# Altium schematic sheet 自控mosV1.0.SchDoc
size A3
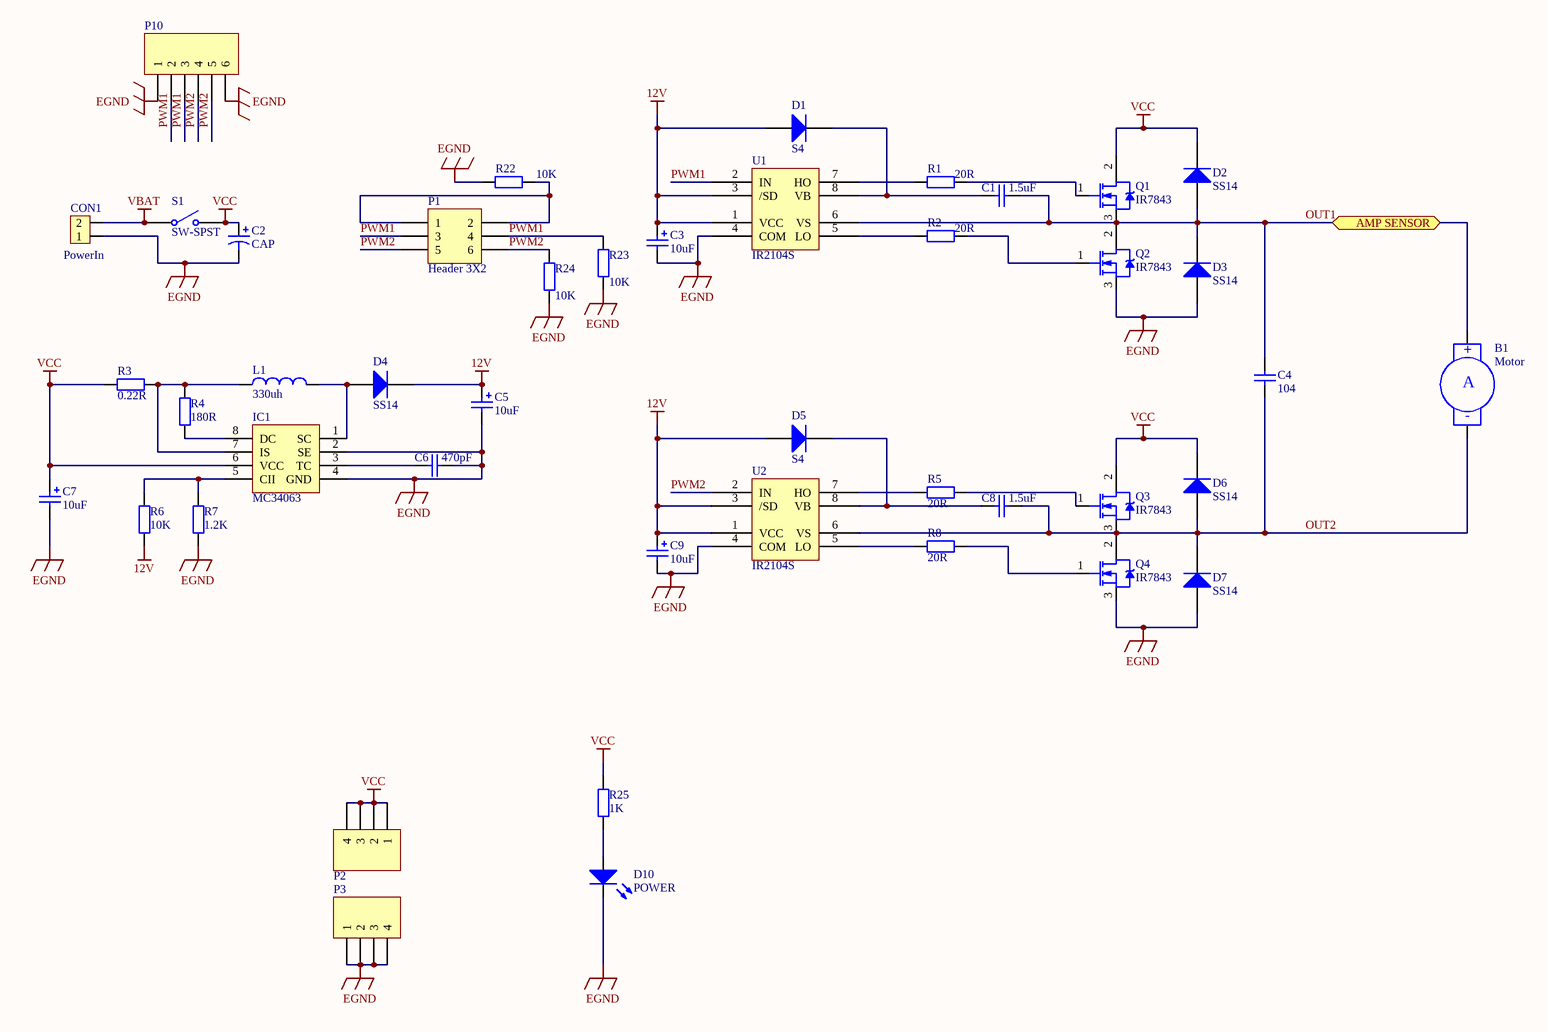
[diagram p0: 自控mosV1.0.SchDoc]

## Parts
B1  Motor  [KF301-2P]
C1  value 1.5uF  [C2012]  (hidden comment: Cap)
C2  CAP  [SMD-EC-F5]
C3  value 10uF  [C2012]  (hidden comment: Cap Pol1)
C4  value 104  [C2012]  (hidden comment: Cap)
C5  value 10uF  [1206C]  (hidden comment: Cap Pol1)
C6  value 470pF  [C2012]  (hidden comment: Cap)
C7  value 10uF  [1206C]  (hidden comment: Cap Pol1)
C8  value 1.5uF  [C2012]  (hidden comment: Cap)
C9  value 10uF  [C2012]  (hidden comment: Cap Pol1)
CON1  PowerIn  [KF301-2P]
D1  S4  [R2012]
D2  SS14  [hole-chip diode]
D3  SS14  [hole-chip diode]
D4  SS14  [hole-chip diode]
D5  S4  [R2012]
D6  SS14  [hole-chip diode]
D7  SS14  [hole-chip diode]
D10  POWER  [C2012]
IC1  MC34063  [MC34063]
L1  value 330uh  [SMD-EC-F12.5]  (hidden comment: Inductor)
P1  Header 3X2  [HDR2X3]
P2  Header 4  [HDR1X4]  (value not drawn)
P3  Header 4  [HDR1X4]  (value not drawn)
P10  Header 6  [FFC/SM1.0-2H6]  (value not drawn)
Q1  IR7843  [LR7843]
Q2  IR7843  [LR7843]
Q3  IR7843  [LR7843]
Q4  IR7843  [LR7843]
R1  value 20R  [R2012]  (hidden comment: Res2)
R2  value 20R  [R2012]  (hidden comment: Res2)
R3  value 0.22R  [SK54]  (hidden comment: Res2)
R4  value 180R  [R2012]  (hidden comment: Res2)
R5  value 20R  [R2012]  (hidden comment: Res2)
R6  value 10K  [R2012]  (hidden comment: Res2)
R7  value 1.2K  [R2012]  (hidden comment: Res2)
R8  value 20R  [R2012]  (hidden comment: Res2)
R22  value 10K  [1206(2)]  (hidden comment: Res2)
R23  value 10K  [R2012]  (hidden comment: Res2)
R24  value 10K  [R2012]  (hidden comment: Res2)
R25  1K  [R2012]
S1  SW-SPST  [SW-125V6A(-)]
U1  IR2104S  [IR2104]
U2  IR2104S  [IR2104]

## Ports
AMP SENSOR

## Nets
12V: C3.1 C5.1 C9.1 D1.1(A) D4.2(K) D5.1(A) R6.1 U1.1(VCC) U1.3(/SD) U2.1(VCC) U2.3(/SD)
EGND: C2.2 C3.2 C5.2 C6.1 C7.2 C9.2 CON1.1 D3.1(A) D7.1(A) D10.2 IC1.2(SE) IC1.4(GND) P3.1 P3.2 P3.3 P3.4 P10.1 P10.6 Q2.3(S) Q4.3(S) R7.1 R22.1 R23.1 R24.1 U1.4(COM) U2.4(COM)
VBAT: CON1.2 S1.1(COMMON)
VCC: C2.1 C7.1 D2.2(K) D6.2(K) IC1.6(VCC) P2.1 P2.2 P2.3 P2.4 Q1.2(D) Q3.2(D) R3.1 R25.2 S1.2(NO)
OUT1: B1.1(+) C1.1 C4.1 D2.1(A) D3.2(K) Q1.3(S) Q2.2(D) U1.6(VS) ; port AMP SENSOR
OUT2: B1.2(-) C4.2 C8.1 D6.1(A) D7.2(K) Q3.3(S) Q4.2(D) U2.6(VS)
PWM1: P1.3 P1.4 P10.2 P10.3 R23.2 U1.2(IN)
PWM2: P1.5 P1.6 P10.4 P10.5 R24.2 U2.2(IN)
NetC1_2: C1.2 D1.2(K) U1.8(VB)
NetC6_2: C6.2 IC1.3(TC)
NetC8_2: C8.2 D5.2(K) U2.8(VB)
NetD4_1: D4.1(A) IC1.1(SC) L1.2
NetD10_1: D10.1 R25.1
NetIC1_5: IC1.5(CII) R6.2 R7.2
NetIC1_7: IC1.7(IS) L1.1 R3.2 R4.2
NetIC1_8: IC1.8(DC) R4.1
NetP1_1: P1.1 P1.2 R22.2
NetQ1_1: Q1.1(G) R1.2
NetQ2_1: Q2.1(G) R2.2
NetQ3_1: Q3.1(G) R5.2
NetQ4_1: Q4.1(G) R8.2
NetR1_1: R1.1 U1.7(HO)
NetR2_1: R2.1 U1.5(LO)
NetR5_1: R5.1 U2.7(HO)
NetR8_1: R8.1 U2.5(LO)

## Notes on the sheet
- (in symbol Motor Servo) A

## Library data of the parts
B1 = Motor Servo: Servo Motor
C1 C4 C6 C8 = Cap: Capacitor; Published: 8-Jun-2000; LatestRevisionDate: 17-Jul-2002; LatestRevisionNote: Re-released for DXP Platform.; PackageReference: RAD-0.3; Publisher: Altium Limited; PackageDescription: Radial Cap, Thru-Hole; 2 Leads; 0.3 in Pin Spacing
C2 = CAP+
C3 C5 C7 C9 = Cap Pol1: Polarized Capacitor (Radial); Published: 8-Jun-2000; LatestRevisionDate: 17-Jul-2002; LatestRevisionNote: Re-released for DXP Platform.; PackageReference: RB7.6-15; Publisher: Altium Limited; PackageDescription: Polarized Capacitor (Radial); 2 Leads
CON1 = Header 2: Header, 2-Pin
D1-D7 = Diode 1N4007: 1 Amp General Purpose Rectifier; Published: 8-Jun-2000; LatestRevisionDate: 17-Jul-2002; LatestRevisionNote: Re-released for DXP Platform.; DatasheetVersion: 1998; PackageVersion: Aug-1999; PackageReference: DO-41; Publisher: Altium Limited; Code_JEDEC: DO-204-AL; ComponentLink1Description: Manufacturer Link; ComponentLink1URL: http://www.fairchildsemi.com/; ComponentLink2Description: Datasheet; ComponentLink2URL: http://www.fairchildsemi.com/ds/1N%2F1N4001.pdf
D10 = LED: Typical INFRARED GaAs LED
L1 = Inductor: Code_IEC: 1005; Published: 8-Jun-2000; LatestRevisionDate: 29-May-2009; LatestRevisionNote: IPC-7351 Footprint Added.; PackageReference: 0402-A; Publisher: Altium Limited; PackageDescription: Chip Inductor; Code_JEITA: 0402
P1 = Header 3X2: Header, 3-Pin, Dual row; LatestRevisionDate: 17-Jul-2002; LatestRevisionNote: Re-released for DXP Platform.; Publisher: Altium Limited
P2 P3 = Header 4: Header, 4-Pin; LatestRevisionDate: 17-Jul-2002; LatestRevisionNote: Re-released for DXP Platform.; Publisher: Altium Limited
P10 = Header 6: Header, 6-Pin; LatestRevisionDate: 17-Jul-2002; LatestRevisionNote: Re-released for DXP Platform.; Publisher: Altium Limited
Q1-Q4 = NMOS-2: N-Channel Power MOSFET; Note: Pin 2 is electrically connected to pin 4.; Published: 8-Jun-2000; LatestRevisionDate: 17-Jul-2002; LatestRevisionNote: Re-released for DXP Platform.; DatasheetVersion: PD-9.814; PackageVersion: Feb-1997; PackageReference: TO-220AB; Publisher: Altium Limited; PackageDescription: TO, Thru-Hole, Vertical, Heatsink Mounted; 3 In-Line Leads; Pitch 2.54 mm; ComponentLink1Description: Manufacturer Link; ComponentLink1URL: http://www.irf.com/
R1 R2 R4-R8 R22-R24 = Res2: Resistor; Published: 8-Jun-2000; LatestRevisionDate: 17-Jul-2002; LatestRevisionNote: Re-released for DXP Platform.; PackageReference: AXIAL-0.4; Publisher: Altium Limited; PackageDescription: Axial Device, Thru-Hole; 2 Leads; 0.4 in Pin Spacing
R3 = Res2: Resistor; pin to pad: 1>K 2>A; Published: 8-Jun-2000; LatestRevisionDate: 17-Jul-2002; LatestRevisionNote: Re-released for DXP Platform.; PackageReference: AXIAL-0.4; Publisher: Altium Limited; PackageDescription: Axial Device, Thru-Hole; 2 Leads; 0.4 in Pin Spacing
R25 = Res: Resistor of led
S1 = SW-SPST: Single-Pole, Single-Throw Switch; Published: 24-Mar-1999; LatestRevisionDate: 17-Jul-2002; LatestRevisionNote: Re-released for DXP Platform.; PackageReference: SPST-2; Publisher: Altium Limited
U1 U2 = Component_1_1